# EAGLE design ioExpand (EAGLE 9.6.2)
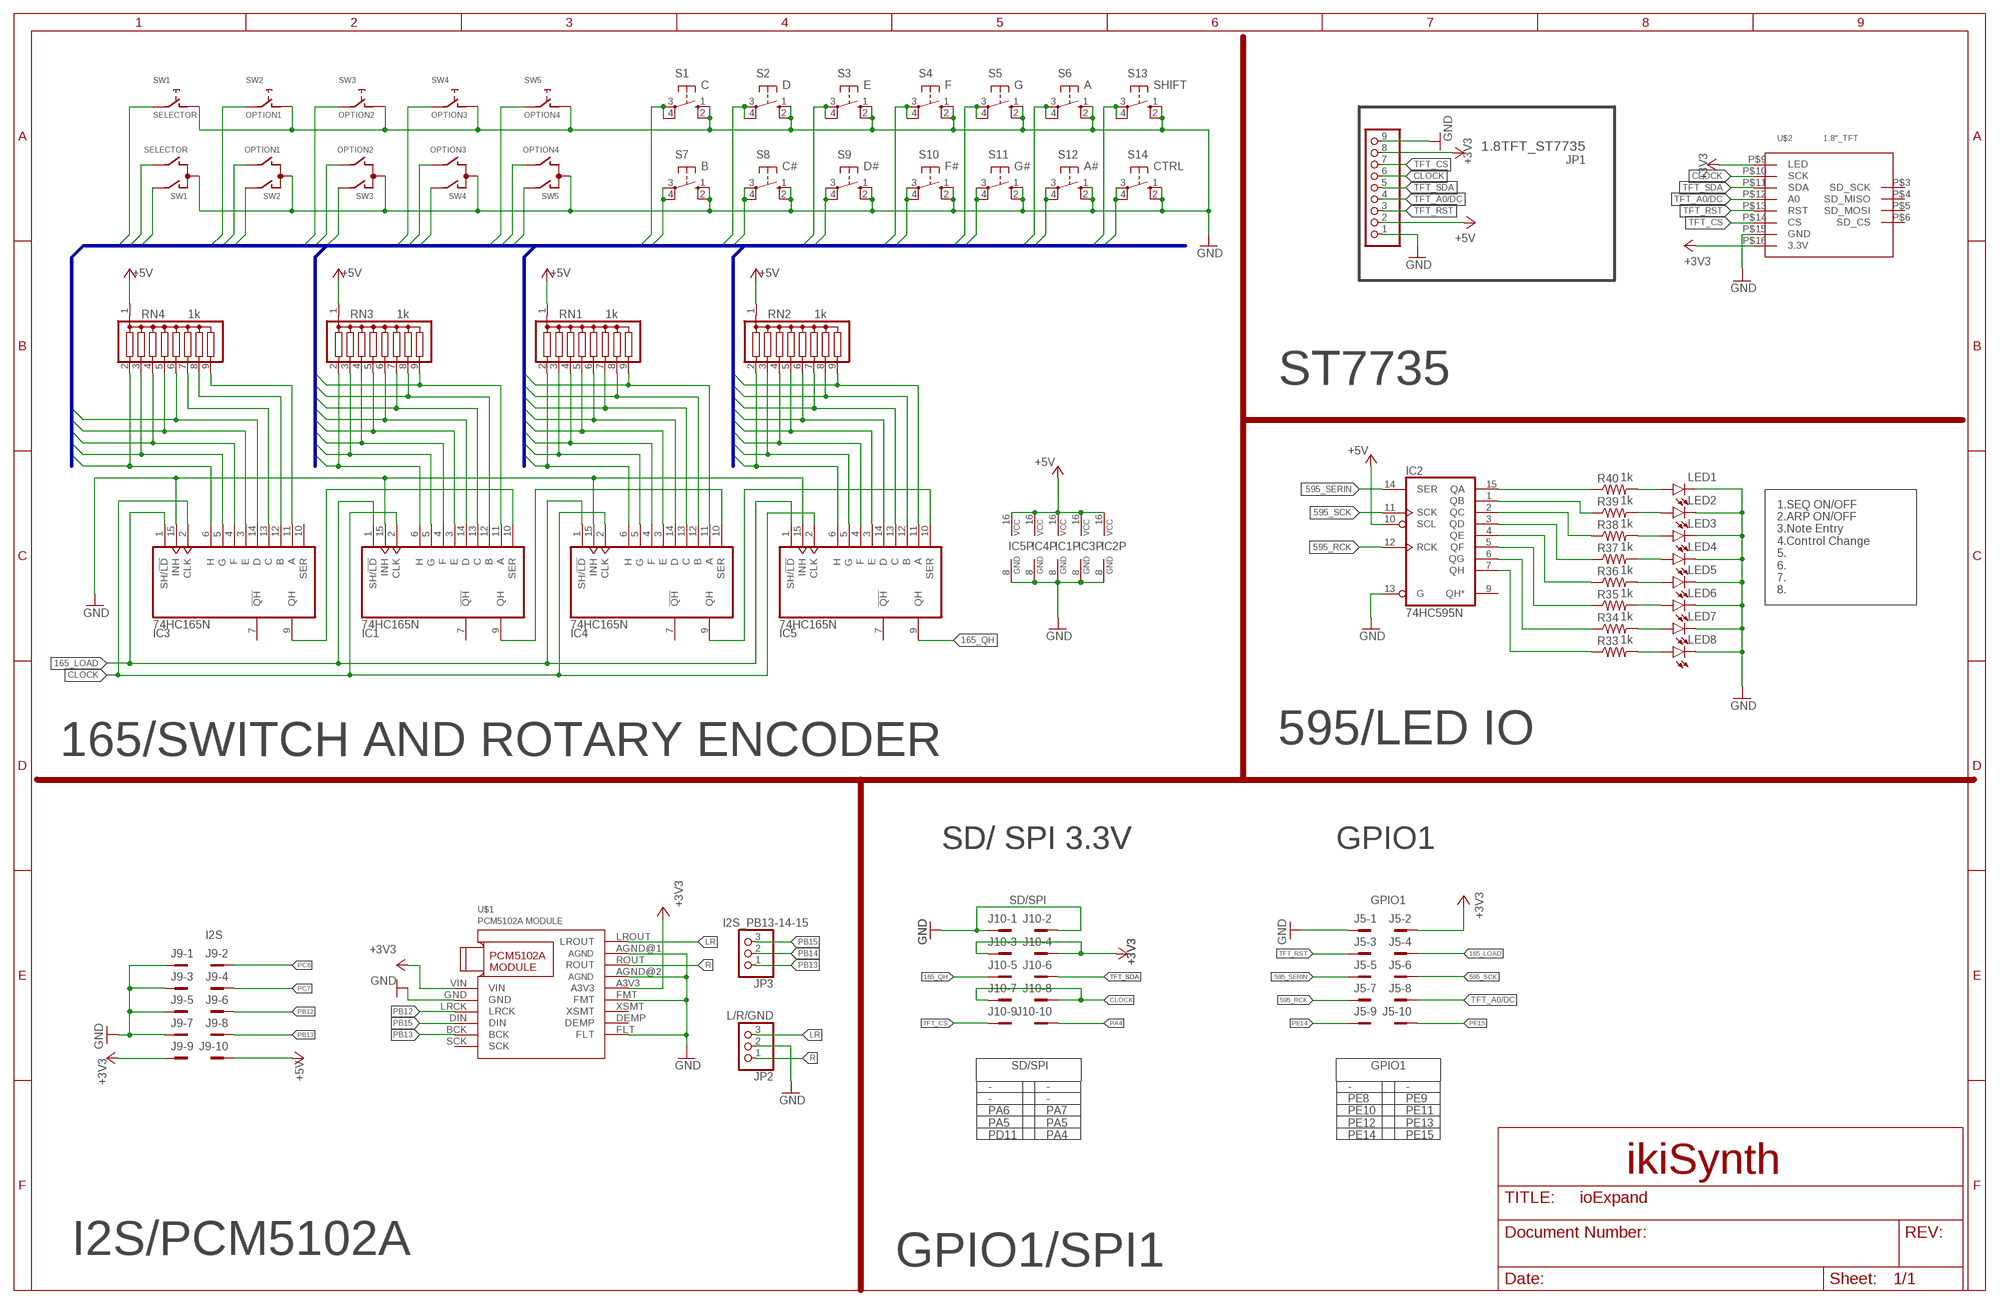
[diagram p0: schematic, sheet 1]
FRAME1 (FRAME_B_L): JUDUL: ikiSynth

## Parts
IC1  74HC165N  [DIL16]
IC2  74HC595N  [DIL16]
IC3  74HC165N  [DIL16]
IC4  74HC165N  [DIL16]
IC5  74HC165N  [DIL16]
J5  GPIO1  2510-  [PAK100/2500-10]
J9  I2S  2510-  [PAK100/2500-10]
J10  SD/SPI  2510-  [PAK100/2500-10]
JP1  1.8TFT_ST7735  PINHD-1X9  [1X09]
JP2  L/R/GND  PINHD-1X3  [1X03]
JP3  I2S_PB13-14-15  PINHD-1X3  [1X03]
LED1  LED3MM  [LED3MM]
LED2  LED3MM  [LED3MM]
LED3  LED3MM  [LED3MM]
LED4  LED3MM  [LED3MM]
LED5  LED3MM  [LED3MM]
LED6  LED3MM  [LED3MM]
LED7  LED3MM  [LED3MM]
LED8  LED3MM  [LED3MM]
R33  1k  R-US_M1206  [M1206]
R34  1k  R-US_M1206  [M1206]
R35  1k  R-US_M1206  [M1206]
R36  1k  R-US_M1206  [M1206]
R37  1k  R-US_M1206  [M1206]
R38  1k  R-US_M1206  [M1206]
R39  1k  R-US_M1206  [M1206]
R40  1k  R-US_M1206  [M1206]
RN1  1k  G08R  [SIL9]
RN2  1k  G08R  [SIL9]
RN3  1k  G08R  [SIL9]
RN4  1k  G08R  [SIL9]
S1  C  40-XX  [B3F-40XX]
S2  D  40-XX  [B3F-40XX]
S3  E  40-XX  [B3F-40XX]
S4  F  40-XX  [B3F-40XX]
S5  G  40-XX  [B3F-40XX]
S6  A  40-XX  [B3F-40XX]
S7  B  40-XX  [B3F-40XX]
S8  C#  40-XX  [B3F-40XX]
S9  D#  40-XX  [B3F-40XX]
S10  F#  40-XX  [B3F-40XX]
S11  G#  40-XX  [B3F-40XX]
S12  A#  40-XX  [B3F-40XX]
S13  SHIFT  40-XX  [B3F-40XX]
S14  CTRL  40-XX  [B3F-40XX]
SW1  SELECTOR  EC12E_SW  [ALPS_EC12E_SW]
SW2  OPTION1  EC12E_SW  [ALPS_EC12E_SW]
SW3  OPTION2  EC12E_SW  [ALPS_EC12E_SW]
SW4  OPTION3  EC12E_SW  [ALPS_EC12E_SW]
SW5  OPTION4  EC12E_SW  [ALPS_EC12E_SW]
U$1  PCM5102A_MODULE  [PCM5102A_MODULE]
U$2  1.8"_TFT  [1.8"_TFT]

## Nets
165_LOAD: IC1.1(SH/!LD) IC3.1(SH/!LD) IC4.1(SH/!LD) IC5.1(SH/!LD) J5.4
165_QH: IC5.9(QH) J10.5
595_RCK: IC2.12(RCK) J5.7
595_SCK: IC2.11(SCK) J5.6
595_SERIN: IC2.14(SER) J5.5
$123: IC3.13(C) RN4.7
+3V3: J5.2 J9.9 J10.3 J10.4 JP1.8 U$1.A3V3 U$1.VIN U$2.P$9(LED) U$2.P$16(3.3V)
+5V: IC1.16(VCC) IC2.10(SCL) IC2.16(VCC) IC3.16(VCC) IC4.16(VCC) IC5.16(VCC) J9.10 JP1.2 RN1.1 RN2.1 RN3.1 RN4.1
CLOCK: IC1.2(CLK) IC3.2(CLK) IC4.2(CLK) IC5.2(CLK) J10.7 J10.8 JP1.6 U$2.P$10(SCK)
CTRL: IC3.3(E) RN4.5 S14.3(P) S14.4(P1)
GND: IC1.8(GND) IC1.15(INH) IC2.8(GND) IC2.13(G) IC3.8(GND) IC3.15(INH) IC4.8(GND) IC4.15(INH) IC5.8(GND) IC5.15(INH) J5.1 J9.1 J9.3 J9.5 J9.7 J10.1 J10.2 JP1.1 JP1.9 JP2.2 LED1.K(C) LED2.K(C) LED3.K(C) LED4.K(C) LED5.K(C) LED6.K(C) LED7.K(C) LED8.K(C) S1.1(S) S1.2(S1) S2.1(S) S2.2(S1) S3.1(S) S3.2(S1) S4.1(S) S4.2(S1) S5.1(S) S5.2(S1) S6.1(S) S6.2(S1) S7.1(S) S7.2(S1) S8.1(S) S8.2(S1) S9.1(S) S9.2(S1) S10.1(S) S10.2(S1) S11.1(S) S11.2(S1) S12.1(S) S12.2(S1) S13.1(S) S13.2(S1) S14.1(S) S14.2(S1) SW1.C SW1.D SW2.C SW2.D SW3.C SW3.D SW4.C SW4.D SW5.C SW5.D U$1.AGND@1(AGND) U$1.AGND@2(AGND) U$1.FLT U$1.FMT U$1.GND U$2.P$15(GND)
KEY1: IC1.11(A) RN3.9 S1.3(P) S1.4(P1)
KEY2: IC1.13(C) RN3.7 S2.3(P) S2.4(P1)
KEY3: IC1.3(E) RN3.5 S3.3(P) S3.4(P1)
KEY4: IC1.4(F) RN3.4 S4.3(P) S4.4(P1)
KEY5: IC4.11(A) RN1.9 S5.3(P) S5.4(P1)
KEY6: IC4.12(B) RN1.8 S6.3(P) S6.4(P1)
KEY7: IC4.14(D) RN1.6 S7.3(P) S7.4(P1)
KEY8: IC1.12(B) RN3.8 S8.3(P) S8.4(P1)
KEY9: IC1.14(D) RN3.6 S9.3(P) S9.4(P1)
KEY10: IC1.5(G) RN3.3 S10.3(P) S10.4(P1)
KEY11: IC1.6(H) RN3.2 S11.3(P) S11.4(P1)
KEY12: IC4.13(C) RN1.7 S12.3(P) S12.4(P1)
LR: JP2.3 U$1.LROUT
N$1: IC2.15(QA) R40.1
N$2: IC2.1(QB) R39.1
N$3: IC2.2(QC) R38.1
N$4: IC2.3(QD) R37.1
N$5: IC2.4(QE) R36.1
N$6: IC2.5(QF) R35.1
N$7: IC2.6(QG) R34.1
N$8: IC2.7(QH) R33.1
N$9: LED1.A R40.2
N$10: LED8.A R33.2
N$11: LED7.A R34.2
N$12: LED6.A R35.2
N$13: LED5.A R36.2
N$14: LED4.A R37.2
N$15: LED3.A R38.2
N$16: LED2.A R39.2
N$34: IC1.10(SER) IC3.9(QH)
N$35: IC1.9(QH) IC4.10(SER)
N$36: IC4.9(QH) IC5.10(SER)
N$44: IC3.11(A) RN4.9
N$45: IC3.12(B) RN4.8
PA4: J10.10
PB12: J9.6 U$1.LRCK
PB13: J9.8 JP3.1 U$1.BCK
PB14: JP3.2
PB15: JP3.3 U$1.DIN
PC6: J9.2
PC7: J9.4
PE14: J5.9
PE15: J5.10
R: JP2.1 U$1.ROUT
ROTSW1: IC3.6(H) RN4.2 SW1.E
ROTSW2: IC5.6(H) RN2.2 SW2.E
ROTSW3: IC5.3(E) RN2.5 SW3.E
ROTSW4: IC5.12(B) RN2.8 SW4.E
ROTSW5: IC4.5(G) RN1.3 SW5.E
ROTSW_AB1: IC3.5(G) RN4.3 SW1.B
ROTSW_AB2: IC3.4(F) RN4.4 SW1.A
ROTSW_AB3: IC5.5(G) RN2.3 SW2.B
ROTSW_AB4: IC5.4(F) RN2.4 SW2.A
ROTSW_AB5: IC5.14(D) RN2.6 SW3.B
ROTSW_AB6: IC5.13(C) RN2.7 SW3.A
ROTSW_AB7: IC5.11(A) RN2.9 SW4.B
ROTSW_AB8: IC4.6(H) RN1.2 SW4.A
ROTSW_AB9: IC4.4(F) RN1.4 SW5.B
ROTSW_AB10: IC4.3(E) RN1.5 SW5.A
SHIFT: IC3.14(D) RN4.6 S13.3(P) S13.4(P1)
TFT_A0/DC: J5.8 JP1.4 U$2.P$12(A0)
TFT_CS: J10.9 JP1.7 U$2.P$14(CS)
TFT_RST: J5.3 JP1.3 U$2.P$13(RST)
TFT_SDA: J10.6 JP1.5 U$2.P$11(SDA)
Unconnected: IC1.7(!QH) IC2.9(QH*) IC3.7(!QH) IC3.10(SER) IC4.7(!QH) IC5.7(!QH) SW1.GND1(G) SW1.GND2(G) SW2.GND1(G) SW2.GND2(G) SW3.GND1(G) SW3.GND2(G) SW4.GND1(G) SW4.GND2(G) SW5.GND1(G) SW5.GND2(G) U$1.DEMP U$1.SCK U$1.XSMT U$2.P$3(SD_SCK) U$2.P$4(SD_MISO) U$2.P$5(SD_MOSI) U$2.P$6(SD_CS)

## Buses
CTRL,KEY[1..12],ROTSW[1..5],ROTSW_AB[1..10],SHIFT

## Notes on the sheet
- ST7735
- 1.SEQ ON/OFF
  2.ARP ON/OFF
  3.Note Entry
  4.Control Change
  5.
  6.
  7.
  8.
- 165/SWITCH AND ROTARY ENCODER | 595/LED IO
- SD/ SPI 3.3V | SD/ SPI 3.3V | GPIO1
- SD/SPI | GPIO1
- -
  -
  PA6
  PA5
  PD11
- -
  -
  PA7
  PA5
  PA4
- -
  PE8
  PE10
  PE12
  PE14
- -
  PE9
  PE11
  PE13
  PE15
- I2S/PCM5102A | GPIO1/SPI1

## Library data of the parts
IC1 IC3-IC5 = 74xx-eu:74*165: 8-bit parallel load SHIFT REGISTER
IC2 = 74xx-eu:74*595: 8-bit SHIFT REGISTER, output latch
J5 J9 J10 = con-3m:2510-: 3M (TM) Pak 100 4-Wall Header Source: 3M; MF: 3M; MPN: 2510-6002UB; OC_FARNELL: 9838244; OC_NEWARK: 46F4725
JP1 = pinhead:PINHD-1X9: PIN HEADER
JP2 JP3 = pinhead:PINHD-1X3: PIN HEADER
LED1-LED8 = led:LED: LED OSRAM: - CHIPLED LG R971, LG N971, LY N971, LG Q971, LY Q971, LO R971, LY R971 LH N974, LH R974 LS Q976, LO Q976, LY Q976 LO Q996 - Hyper CHIPLED LW Q18S LB Q993, LB Q99A, LB R99A - SideLED LS A670, LO A670, LY A670, LG A670, LP A670 LB A673, LV A673, LT A673, LW A673 LH A674 LY A675 LS A676, LA A676, LO A676, LY A676, LW A676 LS A679, LY A679, LG A679 - Hyper Micro SIDELED® LS Y876, LA Y876, LO Y876, LY Y876 LT Y87S - SmartLED LW L88C, LW L88S LB L89C, LB L89S, LG L890 LS L89K, LO L89K, LY L89K LS L896, LA L896, LO L896, LY L896 - TOPLED LS T670, LO T670, LY T670, LG T670, LP T670 LSG T670, LSP T670, LSY T670, LOP T670, LYG T670 LG T671, LOG T671, LSG T671 LB T673, LV T673, LT T673, LW T673 LH T674 LS T676, LA T676, LO T676, LY T676, LB T676, LH T676, LSB T676, LW T676 LB T67C, LV T67C, LT T67C, LS T67K, LO T67K, LY T67K, LW E67C LS E67B, LA E67B, LO E67B, LY E67B, LB E67C, LV E67C, LT E67C LW T67C LS T679, LY T679, LG T679 LS T770, LO T770, LY T770, LG T770, LP T770 LB T773, LV T773, LT T773, LW T773 LH T774 LS E675, LA E675, LY E675, LS T675 LS T776, LA T776, LO T776, LY T776, LB T776 LHGB T686 LT T68C, LB T68C - Hyper Mini TOPLED® LB M676 - Mini TOPLED Santana® LG M470 LS M47K, LO M47K, LY M47K Source: http://www.osram.convergy.de LUXEON: - LUMILED® LXK2-PW12-R00, LXK2-PW12-S00, LXK2-PW14-U00, LXK2-PW14-V00 LXK2-PM12-R00, LXK2-PM12-S00, LXK2-PM14-U00 LXK2-PE12-Q00, LXK2-PE12-R00, LXK2-PE12-S00, LXK2-PE14-T00, LXK2-PE14-U00 LXK2-PB12-K00, LXK2-PB12-L00, LXK2-PB12-M00, LXK2-PB14-N00, LXK2-PB14-P00, LXK2-PB14-Q00 LXK2-PR12-L00, LXK2-PR12-M00, LXK2-PR14-Q00, LXK2-PR14-R00 LXK2-PD12-Q00, LXK2-PD12-R00, LXK2-PD12-S00 LXK2-PH12-R00, LXK2-PH12-S00 LXK2-PL12-P00, LXK2-PL12-Q00, LXK2-PL12-R00 Source: www.luxeon.com KINGBRIGHT: KA-3528ASYC Source: www.kingbright.com
R33-R40 = rcl:R-US_: RESISTOR, American symbol; SPICEPREFIX: R
RN1-RN4 = resistor-sil:G08R: SIL RESISTOR; OC_FARNELL: unknown; OC_NEWARK: unknown
S1-S14 = switch-omron:40-XX: OMRON SWITCH; MF: OMRON COMPONENTS USA; MPN: B3F-4000; OC_FARNELL: 176434; OC_NEWARK: 36K3105
SW1-SW5 = switch-alps:EC12E_SW: ALPS rotary Encoder EC12E series with switch; MPN: EC12E2424407; OC_FARNELL: 1520813; OC_NEWARK: 74M1068
U$1 = PCM5102A_Module:PCM5102A_MODULE: module PCM5102A (small purple package)
U$2 = tft_1_8_1_44_oled_0_96:1.8"_TFT

## Net classes
0 default: clearance 0.15 mm

## Board
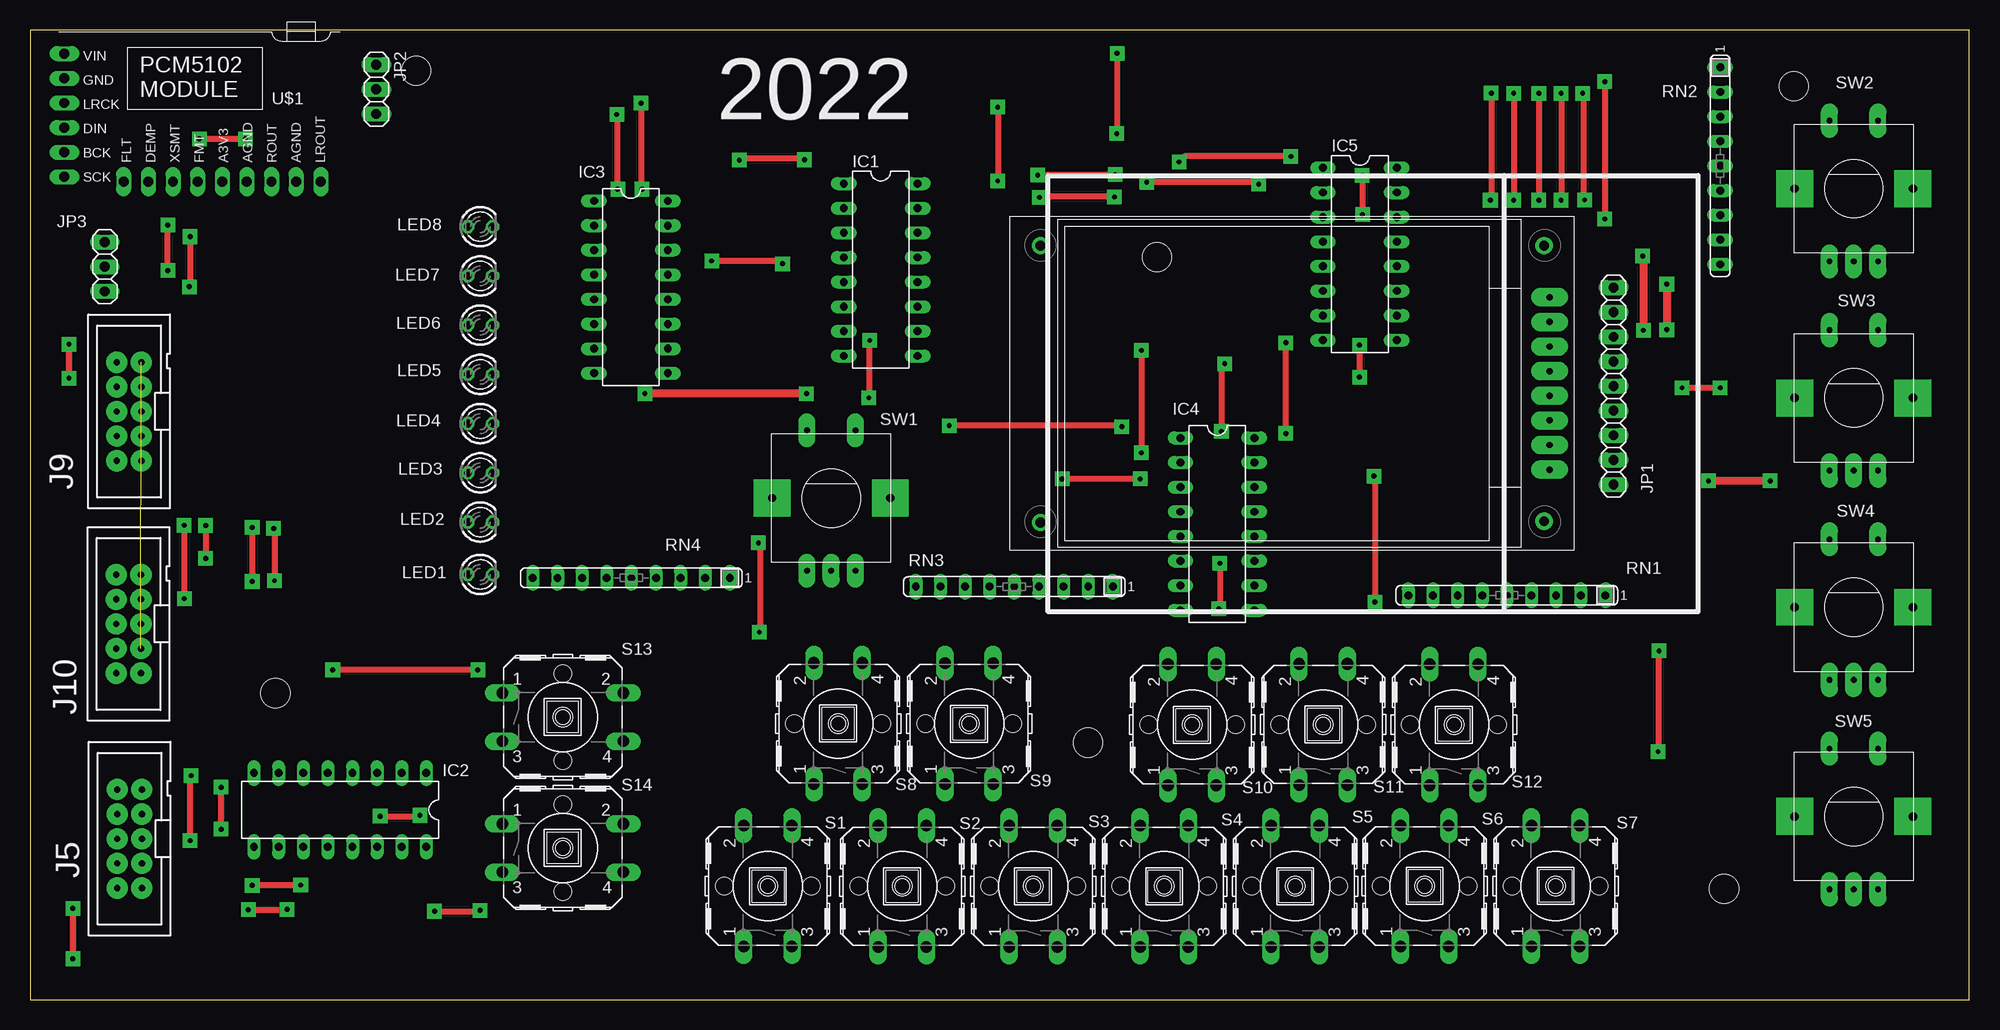
[diagram p1: board, top side]
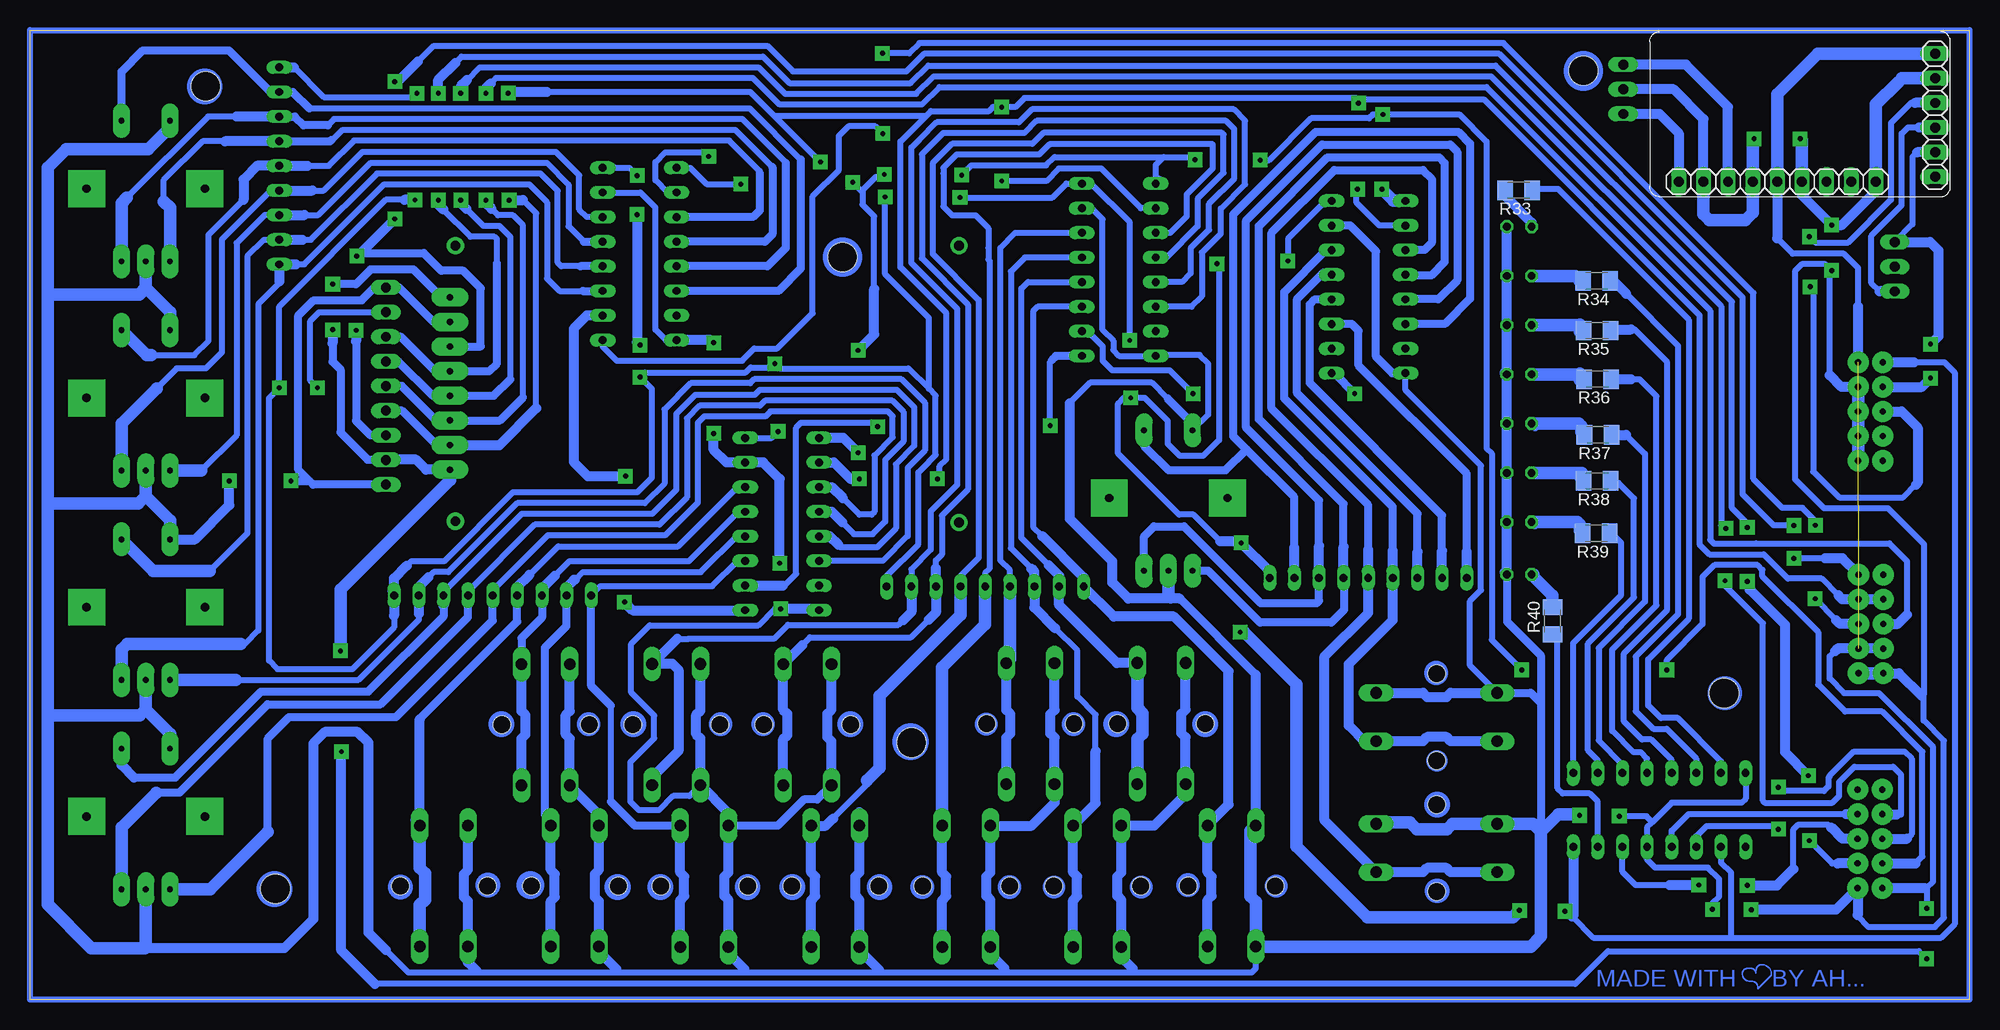
[diagram p2: board, bottom side, seen from below]

Size 200 x 100 mm. Coordinates in mm from the lower left corner, seen from the top.
Outline: 0,0 200,0 200,100 0,100 0,0
Copper layers (1*16): Top 0.035mm / dielectric 1.5mm / Bottom 0.035mm
Design rules "default *": minimum track width 0.6mm, minimum drill 0.5mm, track to track 0.5mm, track to pad 0.5mm, pad to pad 0.6mm, via to via 0.7mm, smd to smd 1mm, copper to edge 40mil, drill to drill 6mil, minimum pad ring 10mil, minimum via ring 8mil, stop-mask expansion 4mil, vias tented up to drill 0mil, thermal gap 10mil
Holes 3 mm at 25.3,31.6 39.8,95.8 181.9,94.2 174.7,11.4 116.2,76.6 109.1,26.5

### Footprints (pad centres in the part's own frame; a part is rotated, then mirrored left to right if it is on the bottom)
DIL16 = drill 0.813 long: 1 -8.89,-3.81; 2 -6.35,-3.81; 3 -3.81,-3.81; 4 -1.27,-3.81; 5 1.27,-3.81; 6 3.81,-3.81; 7 6.35,-3.81; 8 8.89,-3.81; 9 8.89,3.81; 10 6.35,3.81; 11 3.81,3.81; 12 1.27,3.81; 13 -1.27,3.81; 14 -3.81,3.81; 15 -6.35,3.81; 16 -8.89,3.81
PAK100/2500-10 = drill 0.65 pad 2.184: 1 -5.08,-1.27; 2 -5.08,1.27; 3 -2.54,-1.27; 4 -2.54,1.27; 5 0,-1.27; 6 0,1.27; 7 2.54,-1.27; 8 2.54,1.27; 9 5.08,-1.27; 10 5.08,1.27
1X09 = drill 1.016 long: 1 -10.16,0; 2 -7.62,0; 3 -5.08,0; 4 -2.54,0; 5 0,0; 6 2.54,0; 7 5.08,0; 8 7.62,0; 9 10.16,0
1X03 = drill 1.016 long: 1 -2.54,0; 2 0,0; 3 2.54,0
LED3MM = drill 0.813 octagon: A -1.27,0; K 1.27,0
M1206 = smd 1.6 x 2: 1 -1.4,0; 2 1.4,0
SIL9 = drill 0.813 long: 1 -10.16,0; 2 -7.62,0; 3 -5.08,0; 4 -2.54,0; 5 0,0; 6 2.54,0; 7 5.08,0; 8 7.62,0; 9 10.16,0
B3F-40XX = drill 1.194 long: 1 -6.248,2.489; 2 6.248,2.489; 3 -6.248,-2.489; 4 6.248,-2.489 | hole 1.803: 0,-4.496; 0,4.496
ALPS_EC12E_SW = drill 0.6 pad 1.778 long: A -2.5,-7.5; B 2.5,-7.5; C 0,-7.5; D -2.5,7; E 2.5,7 | drill 0.85 pad 3.81 square: GND1 -6.1,0; GND2 6.1,0
PCM5102A_MODULE = drill 1.016 long: A3V3 15.07,17.43; AGND@1 15.07,25.05; AGND@2 15.07,19.97; BCK 12.03,1.15; DEMP 15.07,9.81; DIN 9.49,1.15; FLT 15.07,7.27; FMT 15.07,14.89; GND 4.41,1.15; LRCK 6.95,1.15; LROUT 15.07,27.59; ROUT 15.07,22.51; SCK 14.57,1.15; VIN 1.87,1.15; XSMT 15.07,12.35
1.8"_TFT = drill 1 pad 1.778: P$3 54.992,31.591; P$4 54.992,3.026; P$5 3.049,3.026; P$6 3.049,31.474 | drill 0.65 pad 1.93 long: P$9 2.5,26.14; P$10 2.5,23.6; P$11 2.5,21.06; P$12 2.5,18.52; P$13 2.5,15.98; P$14 2.5,13.44; P$15 2.5,10.9; P$16 2.5,8.36

### Placement (x,y rotation side)
IC1  87.72,75.29 270 top
IC2  31.97,19.56 180 top
IC3  61.96,73.5 270 top
IC4  122.44,49.05 270 top
IC5  137.14,76.91 270 top
J5  10.25,16.58 90 top
J9  10.2,60.66 90 top
J10  10.15,38.74 90 top
JP1  163.31,63.28 270 top
JP2  35.7,93.9 270 top
JP3  7.7,75.6 270 top
LED1  46.42,43.85 0 top
LED2  46.42,49.25 0 top
LED3  46.42,54.33 0 top
LED4  46.42,59.41 0 top
LED5  46.42,64.49 0 top
LED6  46.42,69.57 0 top
LED7  46.42,74.65 0 top
LED8  46.42,79.73 0 top
R33  46.48,83.48 180 bottom
R34  38.43,74.14 180 bottom
R35  38.39,69.01 180 bottom
R36  38.35,64 180 bottom
R37  38.31,58.25 180 bottom
R38  38.39,53.5 180 bottom
R39  38.48,48.1 180 bottom
R40  43,39.06 90 bottom
RN1  152.3,41.7 180 top
RN2  174.3,86 270 top
RN3  101.5,42.6 180 top
RN4  62,43.5 180 top
S1  76.08,11.7 90 top
S2  89.94,11.68 90 top
S3  103.45,11.68 90 top
S4  116.96,11.68 90 top
S5  130.47,11.68 90 top
S6  143.82,11.71 90 top
S7  157.33,11.71 90 top
S8  83.33,28.47 90 top
S9  96.84,28.45 90 top
S10  119.84,28.34 90 top
S11  133.37,28.37 90 top
S12  146.84,28.34 90 top
S13  54.93,29.14 0 top
S14  54.93,15.63 0 top
SW1  82.61,51.73 0 top
SW2  188.08,83.65 0 top
SW3  188.08,62.06 0 top
SW4  188.08,40.47 0 top
SW5  188.08,18.88 0 top
U$1  2.38,99.44 270 top
U$2  159.2,80.8 180 top

### Tracks (layer width: path | path; a pad name or v marks a point on that pad's centre or on a via)
165_LOAD  (via drill 0.5 pad 1.5)
  Top 0.61: v114.6,56.41 114.5,56.51 114.6,56.61 v114.6,66.97 | v126.7,84.11 126.52,84.3 v115.16,84.3 | v111.91,85.11 111.85,85.05 v103.92,85.05 | v60.59,83.59 60.59,91.2 v60.49,91.3 | v79.86,86.64 79.76,86.74 73.28,86.74 v73.14,86.6 | v46.17,34 v31.2,34
  Bottom 0.61: 112.96,73.3 112.96,80.8 114.16,82 114.16,83.3 | IC5.1 131.93,85.8 130.24,84.11 v126.7,84.11 | v115.16,84.3 114.16,83.3 | v111.91,85.11 112.17,84.86 112.8,84.86 114.16,83.49 114.16,83.3 | v73.14,86.6 72.2,86.6 67.89,90.91 61.92,90.91 61.53,91.3 v60.49,91.3 60.48,91.31 52.6,91.31 49.79,88.5 49.79,56.86 49.27,56.33 49.27,37.1 v46.17,34 | 5.56,14.04 4.85,14.75 4.85,25.55 9,29.7 12.8,29.7 15.6,32.5 15.6,37.9 21.34,43.63 21.34,44.33 21.82,44.81 26.3,44.81 27.52,43.59 27.52,38.72 31.2,35.05 v31.2,34 | v79.86,86.64 80.14,86.92 83.1,86.92 | 83.1,86.92 94.35,86.92 95.22,86.05 102.92,86.05 v103.92,85.05 | IC1.1 83.91,86.11 83.1,86.92
  Bottom 1.016: J5.4 5.56,14.04 | v114.6,66.97 112.96,68.61 112.96,73.3 | v114.6,56.41 116.13,57.94 IC4.1
  Bottom 1.27: 83.7,84.39 IC1.1 | IC3.1 59.38,82.39 v60.59,83.59
165_QH  (via drill 0.5 pad 1.5)
  Top 0.61: v15.88,48.92 15.88,41.37 v15.9,41.34 | v112.1,97.6 112.1,89.37 v112.06,89.33
  Bottom 0.61: v15.9,41.34 15.9,41.3 13.75,39.15 | v15.88,48.92 15.88,49.38 17.22,50.72 19.3,50.72 22.28,53.7 22.28,72.89 48.04,98.65 108.29,98.65 109.34,97.6 v112.1,97.6 | IC5.9 140.95,67.35 139.5,65.9 126.57,65.9 125.31,67.16 122.94,67.16 119.3,70.8 119.3,82.86 116.6,85.56 116.6,89.1 115.61,90.09 112.82,90.09 v112.06,89.33
  Bottom 1.016: J10.5 13.35,38.74 13.75,39.15
595_RCK
  Bottom 0.61: 12.7,19.12 28.98,19.12 30.7,17.4 IC2.12
  Bottom 1.016: J5.7 12.7,19.12
595_SCK  (via drill 0.5 pad 1.5)
  Top 0.61: v19.7,17.56 v19.7,21.9
  Bottom 0.61: IC2.11 28.16,16.84 27.1,17.9 20.04,17.9 v19.7,17.56 | v19.7,21.9 19.4,21.9 19,21.5 15,21.5 14.53,21.97 14.53,22.91 14.35,23.08 14.35,23.15 11.91,25.59 6.69,25.59 5.96,24.86 5.96,17.04 6.42,16.58
  Bottom 1.016: J5.6 6.42,16.58
595_SERIN  (via drill 0.5 pad 1.5)
  Top 0.61: v27.9,11.8 22.93,11.8 v22.9,11.77
  Bottom 0.61: 30.9,11.8 34.4,11.8 35.78,13.18 IC2.14 | 14.25,17.75 14.51,18.01 17.7,18.01 18.14,17.57 18.14,13.47
  Bottom 1.016: J5.5 13.08,16.58 14.25,17.75 | v22.9,11.77 19.85,11.77 18.14,13.47 | v27.9,11.8 30.9,11.8
$123
  Bottom 0.813: 56.92,46.2 56.92,50.13 69.34,62.55 69.34,72.26 66.6,75 66,75 IC3.13
  Bottom 1.016: RN4.7 56.92,46.2
+3V3  (via drill 0.5 pad 1.5)  (1 unrouted)
  Top 0.61: v168,35.97 167.9,35.87 v167.9,25.57 | v4.4,9.4 v4.4,4.2
  Top 0.813: v168.8,73.8 v168.8,69.1
  Bottom 0.61: J10.4 J10.3 11.8,36.2 13.6,36.2 | 13.85,35.95 14.4,35.4 14.4,33.1 12.9,31.6 9.3,31.6 3.74,26.04 3.74,12.16 4.4,11.5 | 11.47,71.5 11.47,75.47 12.95,76.94 18.21,76.94 19.81,78.54 | 4.6,11.5 4.4,11.5 | U$2.P$9 157.44,54.66 | 4.4,11.5 v4.4,9.4 | v4.4,4.2 5.2,5 37.26,5 40.64,1.62 164.44,1.62
  Bottom 0.813: JP1.8 163.27,55.7 165.2,55.7 168,58.5 168,65 168.8,65.8 168.8,67.7 | U$2.P$16 157.6,72.44 160.46,75.3 164.9,75.3 166.4,73.8 v168.8,73.8
  Bottom 1.016: 164.44,1.62 167.9,5.08 v167.9,25.57 | J9.9 11.47,71.5 | U$1.A3V3 19.81,78.54 | J10.4 11.8,36.2 | J10.3 13.6,36.2 13.85,35.95 | J5.2 4.6,11.5 | U$2.P$9 159.16,54.66 160.2,55.7 163.27,55.7 | v168.8,69.1 168.8,67.7
  Bottom 1.27: v168,35.97 168,42.3 156.7,53.6 U$2.P$9 | U$1.VIN 15.64,97.57 19.83,93.38 19.83,87.48 19.81,87.46 U$1.A3V3
+5V  (via drill 0.5 pad 1.5)
  Top 0.61: v174.31,63.1 v170.37,63.1 | v160.11,93.49 160.22,93.38 160.22,82.59 v160.32,82.49 | v111.81,82.8 104.16,82.8 v104.1,82.74 | v70.3,76.2 77.3,76.2 v77.6,75.9 | v86.59,67.99 86.5,67.9 v86.5,62.07 | v41.7,9.1 46.3,9.1 v46.4,9.2 | v75.1,47.1 75.3,46.9 75.3,38 v75.2,37.9 | v123.2,65.6 122.86,65.27 v122.86,58.6 | v137.4,85 137.4,81 v137.42,80.98 | v137.1,67.5 v137.1,64.2
  Bottom 0.61: 77.25,47.25 80.01,50.01 81.51,50.01 87.8,56.3 87.8,61.5 87.22,62.08 86.2,62.08 | 86.2,62.08 85.07,62.08 82.7,59.71 82.7,57.34 81.46,56.1 79,56.1 77.39,57.71 77.39,75.69 v77.6,75.9 | IC3.16 66.37,82.39 70.27,78.49 70.27,76.23 v70.3,76.2 | v104.1,82.74 94.57,82.74 93.13,84.18 IC1.16 90.58,84.18 86.59,80.19 v86.59,67.99 | IC5.16 140.95,86.07 | RN1.1 162.86,42.1 | 162.46,39.6 162.46,38.4 166.76,34.1 174.5,34.1 175.37,34.97 175.37,62.03 v174.31,63.1 174.31,71.5 163.31,82.49 161.4,82.49 | v170.37,63.1 171.1,63.83 171.1,70 170.2,70.9 JP1.2 | 5.7,65.74 2.58,65.74 1.52,64.68 1.52,7.77 2.9,6.39 24.7,6.39 | 172.78,96.16 169.71,93.09 160.11,93.09 v160.11,93.49 | 139.6,85.8 IC5.16 | RN3.1 111.66,43.69 108.39,46.96 108.39,54.38 107.31,55.46 107.31,55.48 106.61,56.18 106.61,62.3 107.31,63 | 107.31,63 107.31,70.31 111.81,74.81 v111.81,82.8 | 107.31,63 109.42,65.11 122.71,65.11 v123.2,65.6 123.6,65.2 125.7,65.2 126.2,64.7 136.6,64.7 v137.1,64.2 135.9,63 135.9,53.81 137.4,52.31 150.23,52.31 157.33,45.21 160.69,45.21 161.15,44.75 | 86.2,62.08 86.21,62.07 v86.5,62.07 | 24.7,6.39 38.79,6.39 40.96,8.56 | IC2.10 25.62,14.12 24.6,13.1 24.6,6.49 24.7,6.39 | 40.86,8.6 40.96,8.6 41.2,8.6 v41.7,9.1 | IC4.16 123.53,57.94 v122.86,58.6 | IC5.16 138.2,85.8 v137.4,85
  Bottom 1.016: IC2.16 40.86,8.6 | 40.96,8.6 40.96,8.56 | 72.16,44.36 RN4.1 72.16,44.16 v75.1,47.1 75.25,47.25 77.25,47.25 | v137.42,80.98 137.42,67.82 v137.1,67.5 | RN2.1 172.78,96.16 | v160.32,82.49 161.4,82.49 | 161.15,44.75 162.46,43.44 RN1.1 162.46,39.6 | J9.10 5.7,65.74
  Bottom 1.27: v75.2,37.9 74.8,37.9 69.4,32.5 69.4,15.8 62.1,8.5 47.1,8.5 v46.4,9.2
CLOCK  (via drill 0.5 pad 1.5)
  Top 0.61: v63,92.47 63,83.69 v63.1,83.59 | v99.8,92.06 v99.8,84.44 | v114.49,53.7 v106.44,53.7 | v150.7,93.5 150.7,82.56 v150.6,82.46 | v130.03,86.97 119.07,86.97 v118.5,86.4
  Bottom 0.61: IC3.2 60.85,79.85 63.2,82.2 63.2,83.5 v63.1,83.59 | v99.8,84.44 95.2,84.44 93.9,85.74 89.54,85.74 85.44,81.64 IC1.2 | v106.44,53.7 106.2,53.7 106.2,55.02 105.5,55.72 105.5,70.79 110.25,75.54 110.25,88.51 107.56,91.2 | 107.56,91.2 107.1,91.66 101.1,91.66 100.7,92.06 v99.8,92.06 98.4,92.06 97.47,92.99 63.23,92.99 63,92.77 v63,92.47 62.61,92.86 50.09,92.86 27.82,70.59 27.82,46.96 26.79,45.92 21.21,45.92 18.7,43.41 15.24,43.41 13.52,41.69 | 147.8,61 147.8,81.1 149.16,82.46 | 123.3,91.2 107.56,91.2 | v118.5,86.4 123.3,91.2 | IC5.2 134.26,83.26 135.5,84.5 135.5,86.4 134.5,87.4 130.45,87.4 v130.03,86.97 | 146.7,93.65 125.75,93.65 123.3,91.2
  Bottom 0.813: U$2.P$10 158.1,57.2 161.64,60.74 JP1.6
  Bottom 1.016: J10.8 J10.7 13.12,41.28 13.52,41.69 | U$2.P$10 151.6,57.2 147.8,61 | v150.7,93.5 150.55,93.65 146.7,93.65 | v150.6,82.46 149.16,82.46 | v114.49,53.7 115.39,53.7 117.09,55.4 IC4.2
CTRL
  Bottom 0.813: 62,46.4 62,51 71.96,60.96 71.96,79.1 65.5,85.56 56.34,85.56 55.44,84.66 55.44,78.06 56.19,77.31 IC3.3 | 62,43.3 RN4.5
  Bottom 1.016: S14.3 53.51,13.14 53.92,13.56 55.94,13.56 56.35,13.14 S14.4 66.5,18.46 66.5,35.4 62,39.9 62,43.3 | RN4.5 62,46.4
GND  (via drill 0.5 pad 1.5)
  Top 0.61: v17.45,88.8 v22.2,88.8 | v14.2,75.2 v14.2,79.9 | v22.5,9.26 26.46,9.26 v26.5,9.3 | v36.1,18.9 40.1,18.9 v40.2,19 | v122.7,45 122.7,40.4 v122.6,40.3 | v129.5,58.4 v129.5,67.77
  Top 0.813: v179.46,53.5 v173.1,53.5
  Bottom 0.6: v14.2,75.2 14.84,75.84 17.3,75.84 18,75.14
  Bottom 0.61: 82.68,62 84.31,63.63 90.67,63.63 92.8,61.51 | 59.51,64.61 IC3.8 58.15,62.85 50.38,55.08 50.38,42.23 51.5,41.11 51.5,34.45 S13.1 | SW1.D 78.5,60.34 78.5,65.6 79.4,66.5 83.81,66.5 IC1.8 87.69,66.4 88.3,67 88.3,67.96 89.4,69.06 89.4,80.5 90.54,81.64 IC1.15 | 11.52,8.7 11.52,8.62 10.4,7.5 3.56,7.5 2.63,8.43 2.63,26.7 4.71,28.78 4.71,31.11 | 4.95,31.35 4.71,31.11 | 14.6,80.3 v14.2,79.9 | 7.35,94.65 6.97,95.03 | IC5.15 137.06,83.26 135.5,81.7 135.5,69.1 134.42,68.02 IC5.8 133.52,68.02 | S11.1 132,21 133.68,21 135.15,19.53 137.22,19.53 138.09,20.41 138.09,24.51 135.64,26.96 135.64,29.29 138,31.66 138,36.7 136.1,38.6 124.9,38.6 123.2,40.3 v122.6,40.3 | 14.4,64.4 14.4,75 v14.2,75.2 | IC2.8 23.08,20.72 23.5,20.3 30.7,20.3 32.7,18.3 | 32.7,18.3 33.24,17.76 IC2.13 33.24,14.44 32.4,13.6 26.97,13.6 25.8,12.43 25.8,10.6 26.5,9.9 v26.5,9.3 | 4.71,31.11 4.71,31.51 4.7,31.5 4.7,46.99 8.4,50.69 15,50.69 18,53.69 18,75.14 | 32.7,18.3 33.3,18.9 v36.1,18.9 | 40.3,19.1 v40.2,19 | S6.1 141.33,5.21 | 153.8,2.8 139.2,2.8 | 139.2,2.8 126,2.8 | 126,2.8 112.2,2.8 | 112.2,2.8 99.1,2.8 | 99.1,2.8 85.9,2.8 | 85.9,2.8 74,2.8 73.59,3.21 S1.1 | 154,3 153.8,2.8 | 86.3,3.2 85.9,2.8 | 99.55,3.25 99.1,2.8 | 112.4,3 112.2,2.8 | 126.35,3.15 126,2.8 | 139.55,3.15 139.2,2.8 | 153.8,2.8 161,2.8 163.3,5.1
  Bottom 0.813: 188.2,5.3 188,5.1 | U$2.P$15 158.4,69.9 161.94,73.44 JP1.1 164.51,73.44 165.81,72.14 170.76,72.14 172.34,70.56 172.34,54.64 171.2,53.5 | JP1.9 170.82,53.12 171.2,53.5 | S10.1 118.82,20.62 120.2,20.62 122.89,17.93 S5.2 | LED1.K 47.69,38.99 44.2,35.5 44.2,30.6 | 44.2,30.6 44.2,17.3 | S13.1 45.23,31.63 44.2,30.6 | 73.59,33.51 81.43,41.35 | 82.61,41.61 82.35,41.35 | 59.51,64.61 61.2,66.3 61.2,77.2 63.85,79.85 IC3.15 | SW1.D 80.11,59.43 82.68,62 | v173.1,53.5 171.2,53.5
  Bottom 1.016: 47.91,44.07 LED1.K LED2.K LED3.K LED4.K LED5.K LED6.K LED7.K LED8.K | S7.2 154.84,13.38 155.26,12.96 155.26,10.55 154.84,10.14 S7.1 154.84,3.84 154,3 | 114.47,19.34 S4.2 114.47,13.1 114.89,12.69 114.89,10.68 114.47,10.26 S4.1 114.47,5.07 112.4,3 | S10.1 117.35,26.65 117.77,27.07 117.77,29.48 117.35,29.89 S10.2 | S11.2 130.88,29.8 131.29,29.38 131.29,27.37 130.88,26.95 S11.1 127.98,19.23 S5.2 127.98,13.1 128.4,12.69 128.4,10.68 127.98,10.26 S5.1 127.98,4.78 126.35,3.15 | S12.2 144.35,29.77 144.77,29.35 144.77,27.34 144.35,26.92 S12.1 141.33,19.07 S6.2 141.33,13.38 141.75,12.96 141.75,10.55 141.33,10.14 S6.1 141.33,4.93 139.55,3.15 | S8.2 80.84,29.89 81.26,29.48 81.26,27.46 80.84,27.05 S8.1 80.84,21.16 84.07,17.93 S2.2 87.45,13.1 87.87,12.69 87.87,10.68 87.45,10.26 S2.1 87.45,4.35 86.3,3.2 | S9.2 94.35,29.88 94.77,29.46 94.77,27.45 94.35,27.03 S9.1 94.35,20.29 96.72,17.93 S3.2 100.96,13.1 101.38,12.69 101.38,10.68 100.96,10.26 S3.1 100.96,4.66 99.55,3.25 | S13.2 56.35,31.63 55.94,31.21 53.92,31.21 53.51,31.63 S13.1 | 81.43,41.35 82.35,41.35 86.75,41.35 88.4,43 88.4,45.2 92.8,49.6 92.8,61.51 | 163.3,5.1 165.1,6.9 165.1,26.5 166.2,27.6 169.6,27.6 170.8,26.4 170.8,8.3 173.8,5.3 188.2,5.3 | J9.7 13.2,63.2 14.4,64.4 | U$1.FMT 17.27,82.97 14.6,80.3 | J10.2 7.26,33.66 4.95,31.35 | 11.52,8.7 J5.1 13.76,9.26 v22.5,9.26 | U$1.AGND@1 27.43,90.83 30.5,93.9 JP2.2 | v129.5,67.77 129.76,68.02 IC5.8 | S1.2 73.59,33.51 | IC4.8 118.77,40.3 v122.6,40.3 | v122.7,45 122.7,53.7 124.4,55.4 IC4.15 128.2,55.4 129.5,56.7 v129.5,58.4 | U$1.FLT 9.65,83.4 13.15,79.9 v14.2,79.9
  Bottom 1.016: SW4.D 182.99,47.47 179.46,51 v179.46,53.5
  Bottom 1.27: S14.2 61,18.3 57.7,18.3 56.97,17.57 53.87,17.57 53.33,18.12 S14.1 45.02,18.12 44.2,17.3 | 73.42,18.12 S1.2 74.14,17.4 74.14,10.64 73.59,10.1 S1.1 45.25,5.45 44.2,6.5 44.2,17.3 | 154.84,4.12 S7.1 | 141.33,4.61 S6.1 | 100.96,4.5 S3.1 | 198.2,29.3 198.2,9.8 193.7,5.3 188.2,5.3 188.08,5.42 SW5.C | 198.2,51.15 198.2,29.3 | 198.2,51.15 198.2,72.81 | 198.2,72.81 198.2,85.8 196.26,87.74 187.82,87.74 185.58,89.98 SW2.D | SW4.C 188.08,29.92 | 198.2,29.3 188.7,29.3 188.08,29.92 | SW3.C 188.08,51.92 | 188.08,51.92 188.85,51.15 198.2,51.15 | SW2.C 188.08,73.42 | 198.2,72.81 198.13,72.74 188.76,72.74 188.08,73.42 | J9.1 J9.3 J9.5 J9.7 | J10.1 J10.2 | SW5.D 185.58,27.42 188.08,29.92 | SW4.D 185.58,49.42 188.08,51.92 | SW3.D 185.58,70.92 188.08,73.42 | 47.81,64.61 LED5.K | 44.2,17.3 42.4,19.1 40.3,19.1 | U$1.FMT 17.27,88.62 v17.45,88.8 | 22.3,88.9 v22.2,88.8 22.35,88.65 U$1.AGND@2 22.35,81.16 23.11,80.39 26.8,80.39 27.43,81.02 U$1.AGND@1 | U$1.FLT 9.65,92.35 7.35,94.65 | 6.97,95.03 U$1.GND | SW1.C 82.61,41.61
KEY1
  Bottom 0.6: IC1.11 96.08,71.48 96.56,71 96.56,48.76 95.6,47.8
  Bottom 1.016: S1.3 78.57,10.28 78.15,10.7 78.15,12.71 78.57,13.12 S1.4 | 78.17,17.95 S1.4 | S1.4 76.41,20.11 76.41,33.87 82.03,39.5 88.24,39.5 RN3.9 91.34,43.54 95.6,47.8
KEY2
  Bottom 0.6: IC1.13 97.4,76.56 98.86,75.1 98.86,46.56 96.75,44.45
  Bottom 0.61: 90.12,25.6 90.12,29.37 92,31.25 92,36 94.3,38.3
  Bottom 0.813: 92.43,18.57 S2.4
  Bottom 1.016: S2.3 92.43,10.26 92.01,10.68 92.01,12.69 92.43,13.1 S2.4 90.12,20.24 90.12,25.6 | 94.3,38.3 96.42,40.42 RN3.7 96.42,44.12 96.75,44.45
  Bottom 1.27: S2.4 92.43,18.49
KEY3
  Bottom 0.6: IC1.3 82.4,79.1 80.71,80.79 80.71,83.06 | 105.8,85.2 105.8,81.8 104.9,80.9 | RN3.5 101.5,44 101.06,44.44 101.06,76.27 101.16,76.37 101.16,77.54 | 78.03,88.23 94.8,88.23
  Bottom 0.61: 78.03,88.23 78.03,85.74 80.71,83.06 | 94.8,88.23 94.87,88.23 95.94,87.16 104.45,87.16 105.8,85.81 105.8,85.2 | 104.9,80.9 102.5,80.9 101.16,79.56 101.16,76.37
  Bottom 0.813: 106,17.87 S3.4
  Bottom 1.016: S3.3 105.94,10.26 105.52,10.68 105.52,12.69 105.94,13.1 S3.4
  Bottom 1.27: S3.4 105.94,34.26 101.5,38.7 RN3.5
KEY4
  Bottom 0.6: 79.6,82.6 79.6,79.77 82.81,76.56 IC1.4
  Bottom 0.61: 117.19,18.69 113.69,22.19 113.69,22.59 | RN3.4 104.04,43.7 102.17,45.57 102.17,72.17 106.92,76.92 106.92,86.26 104.91,88.27 96.63,88.27 95.5,89.4 77.1,89.4 76.92,89.22 76.92,85.28 79.6,82.6
  Bottom 0.813: 119.59,17.79 S4.4
  Bottom 1.016: S4.3 119.45,10.26 119.03,10.68 119.03,12.69 119.45,13.1 S4.4 117.94,17.93 117.19,18.69
  Bottom 1.27: RN3.4 104.04,39.68 112.4,31.32 112.4,23.87 113.69,22.59
KEY5
  Bottom 0.61: RN1.9 141.2,42.64 129.65,42.64 127.05,45.24 IC4.11 | 140.1,20.4 140.1,30.3
  Bottom 0.813: S5.4 137.63,17.93 140.1,20.4 | 140.1,30.3 142.14,32.34 RN1.9
  Bottom 1.016: S5.3 132.96,10.26 132.54,10.68 132.54,12.69 132.96,13.1 S5.4
KEY6
  Bottom 0.61: IC4.12 126.45,47.98 126.95,47.98 130.85,44.08 143.02,44.08 143.8,43.3
  Bottom 0.813: 146.5,18.55 146.31,18.35 S6.4 146.31,18.51 146.9,19.1 146.9,36.3 144.68,38.52 RN1.8
  Bottom 1.016: S6.3 146.31,10.14 145.89,10.55 145.89,12.96 146.31,13.38 S6.4 | RN1.8 144.68,42.52 143.9,43.3 143.8,43.3
KEY7
  Bottom 0.61: 148.5,43.8 145.54,46.76 133.15,46.76 127.05,52.86 IC4.14
  Bottom 0.813: 160.4,18.53 S7.4 | RN1.6 149.76,38.98 159.82,28.92
  Bottom 1.016: S7.4 159.82,28.92 | RN1.6 149.76,42.54 148.5,43.8
  Bottom 1.27: S7.4 159.82,13.56 159.27,13.02 159.27,10.3 159.82,9.76 S7.3
KEY8
  Bottom 0.6: 94.92,44.78 97.76,47.62 97.76,73.34 97.08,74.02 IC1.12
  Bottom 0.813: 86.09,34.45 S8.4
  Bottom 1.016: S8.4 87.92,34.72 93.88,40.68 RN3.8 93.88,43.74 94.92,44.78
  Bottom 1.27: S8.4 85.82,30.07 85.27,29.53 85.27,27.41 85.82,26.87 S8.3
KEY9
  Bottom 0.6: RN3.6 98.96,44.3 99.96,45.3 99.96,77.54 98.4,79.1 IC1.14
  Bottom 0.813: 99.66,34.37 S9.4
  Bottom 1.016: S9.3 99.33,27.03 98.91,27.45 98.91,29.46 99.33,29.88 S9.4
  Bottom 1.27: S9.4 98.96,35.07 RN3.6
KEY10
  Bottom 0.6: 120.36,36.56 119.57,37.35 | 76.66,90.65 96.2,90.65 | 78.4,82.1 78.4,79.4 80.31,77.49 80.31,74.92 81.21,74.02 IC1.5
  Bottom 0.61: 119.57,37.35 109.15,37.35 107.3,39.2 | 106.58,44.5 106.58,45.3 105.98,45.9 105.98,49.93 103.28,52.63 103.28,71.71 108.03,76.46 108.03,87.19 105.84,89.38 97.47,89.38 96.2,90.65 | 78.4,82.1 75.81,84.69 75.81,89.8 76.66,90.65
  Bottom 0.813: 122.4,34.66 S10.4
  Bottom 1.016: S10.3 122.33,26.85 121.91,27.27 121.91,29.48 122.33,29.89 S10.4 120.36,36.56 | 107.3,39.2 106.58,39.92 RN3.3 106.58,44.5
KEY11
  Bottom 0.6: 109.95,39.15 110.45,38.65 121.85,38.65 123.28,37.22 | 133.25,37.22 132.1,37.22 | 75.87,91.83 96.7,91.83 | 108.3,88.7 109.12,87.88 | IC1.6 80.21,71.48 79.15,72.54 79.15,77.05 77.2,79 77.2,81.6
  Bottom 0.61: 109.12,87.88 109.14,87.86 109.14,76 104.39,71.25 104.39,53.09 107.12,50.36 107.12,46.4 109.12,44.4 RN3.2 | 123.28,37.22 132.1,37.22 | 77.2,81.6 74.7,84.1 74.7,90.66 75.87,91.83 | 96.7,91.83 98.04,90.49 106.51,90.49 108.3,88.7
  Bottom 0.813: 135.88,34.65 S11.4
  Bottom 1.016: S11.3 135.85,22.93 133.13,25.64 133.13,34 133.75,34.62 S11.4 133.25,37.22 | RN3.2 109.12,39.98 109.95,39.15
KEY12
  Bottom 0.61: IC4.13 126.95,50.32 132.05,45.22 144.38,45.22 145.9,43.7
  Bottom 0.813: 149.52,34.78 S12.4 149.33,37.29 147.22,39.4 RN1.7
  Bottom 1.016: S12.3 149.33,26.92 148.91,27.34 148.91,29.35 149.33,29.77 S12.4 | RN1.7 147.22,42.38 145.9,43.7
LR
  Bottom 1.016: JP2.3 31.96,91.36 29.97,89.37 U$1.LROUT
N$1
  Bottom 0.61: 38.2,15.63 IC2.15 38.32,20.42 39.14,21.24 41.94,21.24 42.49,21.79 42.49,37.56 43,37.56 R40.1
N$2
  Bottom 0.61: 36.88,47.9 R39.1 36.88,48.1 35.89,47.11 35.89,41.74 40.86,36.77 IC2.1
N$3
  Bottom 0.61: R38.1 36.79,53.3 36.19,53.3 34.58,51.69 34.58,41.48 39.34,36.72 39.34,25.71 38.32,24.69 IC2.2
N$4
  Bottom 0.61: 35.41,58.25 33.45,56.29 33.45,41.05 38.23,36.26 38.23,26.73 35.78,24.28 IC2.3
  Bottom 1.016: R37.1 35.41,58.25
N$5
  Bottom 0.61: 34.9,64 34.01,64 32.26,62.24 32.26,40.66 36.82,36.1 36.82,27.69 34.63,25.5 33.9,25.5 33.24,24.84 IC2.4
  Bottom 1.016: R36.1 34.9,64
N$6
  Bottom 0.61: 34.9,69.11 34.51,69.11 31.15,65.75 31.15,40.2 35.63,35.73 35.63,28.66 33.77,26.81 32.81,26.81 30.7,24.7 IC2.5
  Bottom 1.016: R35.1 36.89,69.11 34.9,69.11
N$7
  Bottom 0.61: IC2.6 28.16,24.86 31.22,27.92 32.61,27.92 34.42,29.73 34.42,35.37 30.04,39.74 30.04,67.44 35.4,72.8
  Bottom 1.016: R34.1 36.74,74.14 35.4,72.8
N$8
  Bottom 0.61: IC2.7 25.62,24.59 30.06,29.03 31.8,29.03 33.11,30.34 33.11,35.11 28.93,39.28 28.93,70.14 42.4,83.6 45.2,83.6 R33.1
N$9
  Bottom 1.27: 44.99,43.85 LED1.A 43,41.7 R40.2
N$10
  Bottom 1.016: LED8.A 45.15,80.15 48.08,83.08 48.08,83.68 R33.2
N$11
  Bottom 1.27: LED7.A 40.62,74.65 40.22,74.25 40.22,74.14 R34.2
N$12
  Bottom 0.813: 44.91,69.81 LED6.A
  Bottom 1.27: LED6.A 40.23,69.57 40.19,69.61 40.19,68.91 40.09,69.01 R35.2
N$13
  Bottom 1.27: LED5.A 40.26,64.49 40.15,64.6 40.15,63.9 40.05,64 R36.2
N$14
  Bottom 0.813: 44.79,59.05 LED4.A
  Bottom 1.27: LED4.A 40.27,59.41 40.01,59.15 40.01,58.55 R37.2
N$15
  Bottom 1.27: LED3.A 45.12,54.3 39.99,54.3 40.09,54.2 40.09,53.8 R38.2
N$16
  Bottom 0.813: 44.8,48.9 LED2.A
  Bottom 1.27: LED2.A 40.43,49.25 40.18,49 40.18,48.4 R39.2
N$17
  Bottom 0.61: 200,100 0,100 0,0 200,0 200,100
N$20
  Bottom 0.152: 20.4,2.5 21.8,1.1 21.8,1.2 arc-90 22.5,1.9 22.7,1.9 arc90 23.4,2.6 23.4,2.7 arc90 22.9,3.2 22.5,3.2 arc90 22,2.7 22,3 arc90 21.4,3.6 arc90 20.4,2.6 20.4,2.5
N$34  (via drill 0.5 pad 1.5)
  Top 0.813: v80.07,62.5 v63.4,62.5
  Bottom 0.61: v80.07,62.5 82.47,64.9 88.4,64.9 89.4,65.9 89.4,67.4 90.94,68.94 IC1.10
  Bottom 0.813: IC3.9 65.51,64.61 v63.4,62.5
N$35  (via drill 0.5 pad 1.5)
  Top 0.61: v94.8,59.2 112.2,59.2 112.3,59.1 v112.6,59.1
  Bottom 0.61: v94.8,59.2 94.8,65.8 94.6,66 | 122.4,42.7 122.2,42.7 121,43.9 121,59 120.5,59.5 113,59.5 v112.6,59.1
  Bottom 0.813: IC1.9 94.2,66.4 94.6,66
  Bottom 1.016: IC4.10 122.4,42.7
N$36  (via drill 0.5 pad 1.5)
  Top 0.61: v138.6,54 138.7,54 v138.7,41
  Bottom 1.016: v138.7,41 137.86,40.16 IC4.9 | IC5.10 142.59,70.56 143.95,69.2 143.95,55.45 142.5,54 v138.6,54
N$44
  Bottom 0.813: 51.84,46.2 51.84,54.24 63,65.4 63,69 63.69,69.69 IC3.11
  Bottom 1.016: RN4.9 51.84,46.2
N$45
  Bottom 0.813: 54.38,46.3 54.38,49.95 68.02,63.59 68.02,71.7 67.49,72.23 IC3.12
  Bottom 1.016: RN4.8 54.38,46.3
PB12  (via drill 0.5 pad 1.5)
  Top 0.61: v16.5,78.7 16.5,73.62 v16.41,73.53
  Bottom 0.61: U$1.LRCK 3.64,92.6 | 5.51,53.12 6.83,51.8 13.44,51.8 16.1,54.46 16.1,73.22 v16.41,73.53 | 5.6,92.49 6.01,92.49 8.08,90.42 8.08,82.96 8.1,82.94 8.1,82.5 12.5,78.1 15.9,78.1 v16.5,78.7
  Bottom 1.016: J9.6 6.99,60.66 5.33,59 5.33,53.3 5.51,53.12 | U$1.LRCK 5.6,92.49
PB13  (via drill 0.5 pad 1.5)
  Top 0.61: v4,67.6 v4,64.1
  Bottom 0.61: 5.39,87.41 5.86,86.94 5.86,79.98 JP3.1
  Bottom 1.016: J9.8 4.9,63.2 v4,64.1 | JP3.1 4.04,78.14 3.2,77.3 3.2,68.4 v4,67.6 | U$1.BCK 5.39,87.41
PB15
  Bottom 0.61: 9.26,73.06 10.1,73.9 10.1,78.8 6.97,81.93 6.97,89.33 6.35,89.95 5.2,89.95
  Bottom 1.016: JP3.3 9.26,73.06 | U$1.DIN 5.2,89.95
R
  Bottom 1.016: U$1.ROUT 24.89,92.09 29.24,96.44 JP2.1
ROTSW1
  Bottom 0.813: 69.62,46.6 69.62,51.82 74.55,56.75 | IC3.6 54.11,69.69 51.5,72.3 51.5,88.3 52.7,89.5 67.4,89.5 75.9,81 75.9,58.1 74.55,56.75 | SW1.E 85.11,57.11 82.6,54.6 76.7,54.6 74.55,56.75
  Bottom 1.016: RN4.2 69.62,46.6
ROTSW2
  Bottom 0.61: 171.21,91.93 125.8,91.93 120.53,86.65
  Bottom 0.813: SW2.E 190.58,95.72 188.38,97.92 179.5,97.92 175.2,93.62 RN2.2 172.9,93.62 171.21,91.93 | IC5.6 122.83,73.1 120.53,75.4 120.53,86.65
ROTSW3
  Bottom 0.61: 187.5,66.48 183.08,66.48 181.61,67.95 181.61,78.89 178,82.5 | 173.6,86 RN2.5 | 124.77,85.2 124.77,85.47 127.9,88.6 166.6,88.6 169.2,86 171.4,86
  Bottom 0.813: IC5.3 125.44,80.72 124.77,81.4 124.77,85.2
  Bottom 1.016: 171.4,86 RN2.5 176.6,86 178,84.6 178,82.5
  Bottom 1.27: SW3.E 188,66.48 187.5,66.48
ROTSW4
  Bottom 0.61: RN2.8 175.88,78.38 177.59,76.67 177.59,48.1 181.49,44.2 | 171.9,78.38 171.06,78.38 164.23,85.21 147.35,85.21 145.58,83.44 145.58,76 145.22,75.64 143.24,75.64
  Bottom 0.813: RN2.8 173.46,78.38 | IC5.12 143.24,75.64
  Bottom 1.016: RN2.8 171.9,78.38
  Bottom 1.27: SW4.E 187.31,44.2 181.49,44.2
ROTSW5
  Bottom 0.61: RN1.3 157.38,42.02 149.31,50.09 135.85,50.09 133.37,52.56 133.37,60.42 131.41,62.38 125.28,62.38 124.77,62.89 110.61,62.89 108.83,61.1 108.83,57.1 110.71,55.21 110.71,48.59 112.62,46.68 116.43,46.68 116.67,46.92
  Bottom 0.813: 157.38,40.6 157.38,39.51 165.13,31.76 176.18,31.76 185.03,22.9 189.3,22.9
  Bottom 1.016: SW5.E 190.58,24.18 189.3,22.9 | RN1.3 157.38,40.6 | IC4.5 117.53,47.78 116.67,46.92
ROTSW_AB1
  Bottom 0.813: SW1.B 85.11,47.79 84.1,48.8 81,48.8 73.1,40.9 67.3,40.9 67.08,41.12 RN4.3 | 67.08,46.8 67.08,51.48 74.59,58.99 74.59,80.36 66.76,88.19 53.54,88.19 52.81,87.46 52.81,74.19 54.77,72.23 IC3.5
  Bottom 1.016: RN4.3 67.08,46.8
ROTSW_AB2
  Bottom 0.813: SW1.A 78.49,44.23 73.14,38.89 65.81,38.89 64.5,40.2 64.5,43.46 RN4.4 | 64.54,46.7 64.54,51.14 73.27,59.87 73.27,79.8 66.2,86.87 54.7,86.87 54.13,86.3 54.13,76.07 55.5,74.7 58.08,74.7 IC3.4
  Bottom 1.016: RN4.4 64.54,46.7
ROTSW_AB3
  Bottom 0.61: 190.02,82.72 181.66,91.08 178.7,91.08 | 122.04,86.31 126.55,90.82 168.65,90.82 169.29,90.18
  Bottom 0.813: IC5.5 123.96,75.64 122.04,77.56 122.04,86.31 | RN2.3 172.7,91.08 171.8,90.18 169.29,90.18
  Bottom 1.016: RN2.3 178.7,91.08
  Bottom 1.27: SW2.B 190.58,82.16 190.02,82.72
ROTSW_AB4
  Bottom 0.61: 179.9,88.54 182.23,88.54 186.21,84.56 186.21,82.3 | 168.92,88.69 168.78,88.69 167.76,89.71 127.3,89.71 123.45,85.87
  Bottom 0.813: IC5.4 124.22,78.18 123.45,78.95 123.45,85.87 | RN2.4 169.07,88.54 168.92,88.69
  Bottom 1.016: RN2.4 179.9,88.54
  Bottom 1.27: SW2.A 185.58,81.67 186.21,82.3
ROTSW_AB5
  Bottom 0.61: 174.94,83.46 RN2.6 175.17,83.46 180.2,78.43 180.2,66.79 181.89,65.1 184.9,65.1 186.95,63.05 | 170.9,83.46 169.71,83.46 165.74,87.43 145.76,87.43 143.36,85.03 143.36,81.5 142.58,80.72 IC5.14
  Bottom 0.813: RN2.6 173.48,83.46 | 141.82,80.72 IC5.14
  Bottom 1.016: RN2.6 170.9,83.46
  Bottom 1.27: SW3.B 190.58,59.42 186.95,63.05
ROTSW_AB6
  Bottom 0.61: RN2.7 175.81,80.92 178.7,78.03 178.7,58.2 182.34,54.56 | 171.7,80.92 170.28,80.92 164.88,86.32 146.71,86.32 144.47,84.08 144.47,79.77 142.88,78.18
  Bottom 0.813: 142.88,78.18 IC5.13
  Bottom 1.016: RN2.7 171.7,80.92
  Bottom 1.27: 182.34,54.56 SW3.A
ROTSW_AB7
  Bottom 0.61: 174.3,74.1 174.3,73.9 176.48,71.72 176.48,38.05 177.83,36.7 178.3,36.7 | 172.6,75.84 171.73,75.84 163.47,84.1 148.54,84.1 146.69,82.25 146.69,74.39 145.4,73.1 143,73.1
  Bottom 0.813: 143,73.1 IC5.11 | 173.95,75.84 RN2.9
  Bottom 1.016: 172.6,75.84 RN2.9 174.3,74.1
  Bottom 1.27: SW4.B 190.58,36.12 190,36.7 178.3,36.7
ROTSW_AB8
  Bottom 0.61: IC4.6 112.06,45.24 109.5,47.8 109.5,54.85 107.72,56.64 107.72,61.56 110.15,64 125.33,64 125.74,63.59 131.87,63.59 134.58,60.88 134.58,53.22 136.61,51.2 149.77,51.2 156.87,44.1 158.4,44.1 158.95,43.55 | 178.8,32.97 166.13,32.97 159.92,39.18 159.92,39.8
  Bottom 0.813: 185.25,33.3 SW4.A
  Bottom 1.016: 158.95,43.55 159.92,42.58 RN1.2 159.92,39.8
  Bottom 1.27: SW4.A 178.8,32.97
ROTSW_AB9
  Bottom 0.61: RN1.4 154.84,42.09 147.95,48.98 135.09,48.98 132.26,51.8 132.26,59.94 130.94,61.27 124.72,61.27 124.21,61.78 111.07,61.78 109.94,60.64 109.94,57.56 111.82,55.67 111.82,49.3 113.1,48.02 115.03,48.02 116.25,49.24
  Bottom 0.813: RN1.4 154.84,39.46 163.85,30.45 175.51,30.45 184.63,21.33 187,21.33
  Bottom 1.016: IC4.4 117.33,50.32 116.25,49.24
  Bottom 1.27: 187,21.33 190.58,17.75 SW5.B
ROTSW_AB10
  Bottom 0.61: RN1.5 152.3,42.2 146.63,47.87 134.53,47.87 131.16,51.24 131.16,59.48 130.48,60.16 124.16,60.16 123.65,60.67 111.53,60.67 111.05,60.18 111.05,58.02 112.93,56.13 112.93,50.3 113.21,50.02 114.48,50.02 116.19,51.72
  Bottom 0.813: 175.5,17.3 175.5,26.93 173.3,29.13 162.27,29.13 152.3,39.1 152.3,42.2
  Bottom 1.016: IC4.3 117.33,52.86 116.19,51.72
  Bottom 1.27: SW5.A 181.42,11.38 175.5,17.3
SHIFT
  Bottom 0.813: 59.46,46.3 59.46,50.82 70.65,62.01 70.65,73 66.34,77.31 IC3.14
  Bottom 1.016: S13.3 53.51,26.65 53.92,27.07 55.94,27.07 56.35,26.65 S13.4 62.38,26.65 64,28.27 64,34.6 59.46,39.14 RN4.6 59.46,46.3
TFT_A0/DC  (via drill 0.5 pad 1.5)
  Top 0.61: v155.59,82.46 155.59,93.48 v155.6,93.49 | v25.1,48.6 25.2,48.5 v25.2,43.2
  Bottom 0.61: v25.1,48.6 25.18,48.52 25.61,48.95 25.61,71.51 49.33,95.24 106.8,95.24 108.62,93.42 122.14,93.42 124.89,96.17 153.64,96.17 154.96,94.86 | 7.5,19.1 7.07,19.1 7.07,23.2 7.87,24 11.87,24 13.42,22.45 13.42,21 14.12,20.3 21.1,20.3 21.3,20.5 21.3,38.8 25.2,42.7 v25.2,43.2 | 150.47,64 150.47,78.67 151.6,79.8 153.24,79.8 155.02,81.58
  Bottom 0.813: JP1.4 162.02,65.82 158.48,62.28 U$2.P$12 152.19,62.28 150.47,64
  Bottom 1.016: J5.8 8.96,19.1 7.5,19.1 | v155.6,93.49 155.6,94.21 154.96,94.86 | v155.59,82.46 155.59,82.15 155.02,81.58
TFT_CS  (via drill 0.5 pad 1.5)
  Top 0.61: v18.1,45.5 v18.1,48.89 v18.09,48.9 | v162.39,94.69 v162.4,94.69 v162.4,80.52
  Top 0.813: v166.31,76.7 166.38,76.63 v166.38,69.03
  Bottom 0.61: 14.86,45.5 v18.1,45.5 | v18.09,48.9 20.19,48.9 23.39,52.1 23.39,72.43 48.5,97.54 107.83,97.54 109.64,95.74 121.32,95.74 123.97,98.39 158.38,98.39 159.99,96.78 | 166.22,76.7 v166.31,76.7
  Bottom 0.813: U$2.P$14 153.52,67.36 153.52,73.38 155.32,75.18 157.59,75.18 159.42,77 166.01,77 v166.31,76.7 | 166.38,67.9 166.38,59.68 164.9,58.2 JP1.7
  Bottom 1.016: J10.9 13.1,45.5 14.86,45.5 | v162.39,94.69 162.07,94.69 159.99,96.78 | v162.4,80.52 166.22,76.7 | v166.38,69.03 166.38,67.9
TFT_RST  (via drill 0.5 pad 1.5)
  Top 0.61: v157.9,93.49 v157.9,82.46 | v16.5,16.4 16.5,22.99 v16.61,23.09 | v22.9,48.7 v22.9,43.12
  Bottom 0.61: 13.6,14.04 14.14,14.04 v16.5,16.4 | v22.9,48.7 22.9,49.1 24.5,50.7 24.5,71.97 48.87,96.35 107.36,96.35 109.18,94.53 121.68,94.53 124.43,97.28 155.5,97.28 156.14,96.64 | 151.86,75.96 151.86,78.45 152.1,78.69 154.59,78.69 157.4,81.5
  Bottom 0.813: JP1.3 161.76,68.36 158.22,64.82 U$2.P$13 152.67,64.82 151.86,65.62 151.86,75.96
  Bottom 1.016: v16.61,23.09 19,25.5 19,38.65 22.65,42.29 22.65,42.87 v22.9,43.12 | J5.3 13.6,14.04 | v157.9,93.49 157.9,94.88 156.14,96.64 | v157.9,82.46 157.9,82 157.4,81.5
TFT_SDA  (via drill 0.5 pad 1.5)
  Top 0.61: v153,93.49 v153,82.46
  Bottom 0.61: 152.5,94.5 151.94,95.06 125.45,95.06 122.7,92.31 108.06,92.31 106.24,94.13 49.79,94.13 26.71,71.06 26.71,47.41 26.34,47.03 22,47.03 21.98,47.05 8.26,47.05 6.41,45.21 6.41,39.7 | 149.17,62.12 149.17,79.87 150.21,80.91 151.75,80.91 152.42,81.58
  Bottom 0.813: JP1.5 161.68,63.28 158.14,59.74 U$2.P$11 151.55,59.74 149.17,62.12
  Bottom 1.016: J10.6 7.37,38.74 6.41,39.7 | v153,93.49 153,94 152.5,94.5 | v153,82.46 153,82.16 152.42,81.58
(copper drawn outside any net)
  shapes: Bottom circle x34

### Text on the board
Bottom: MADE WITH BY AH...
tPlace: 2022